# EAGLE design receiver (EAGLE 6.5.0)
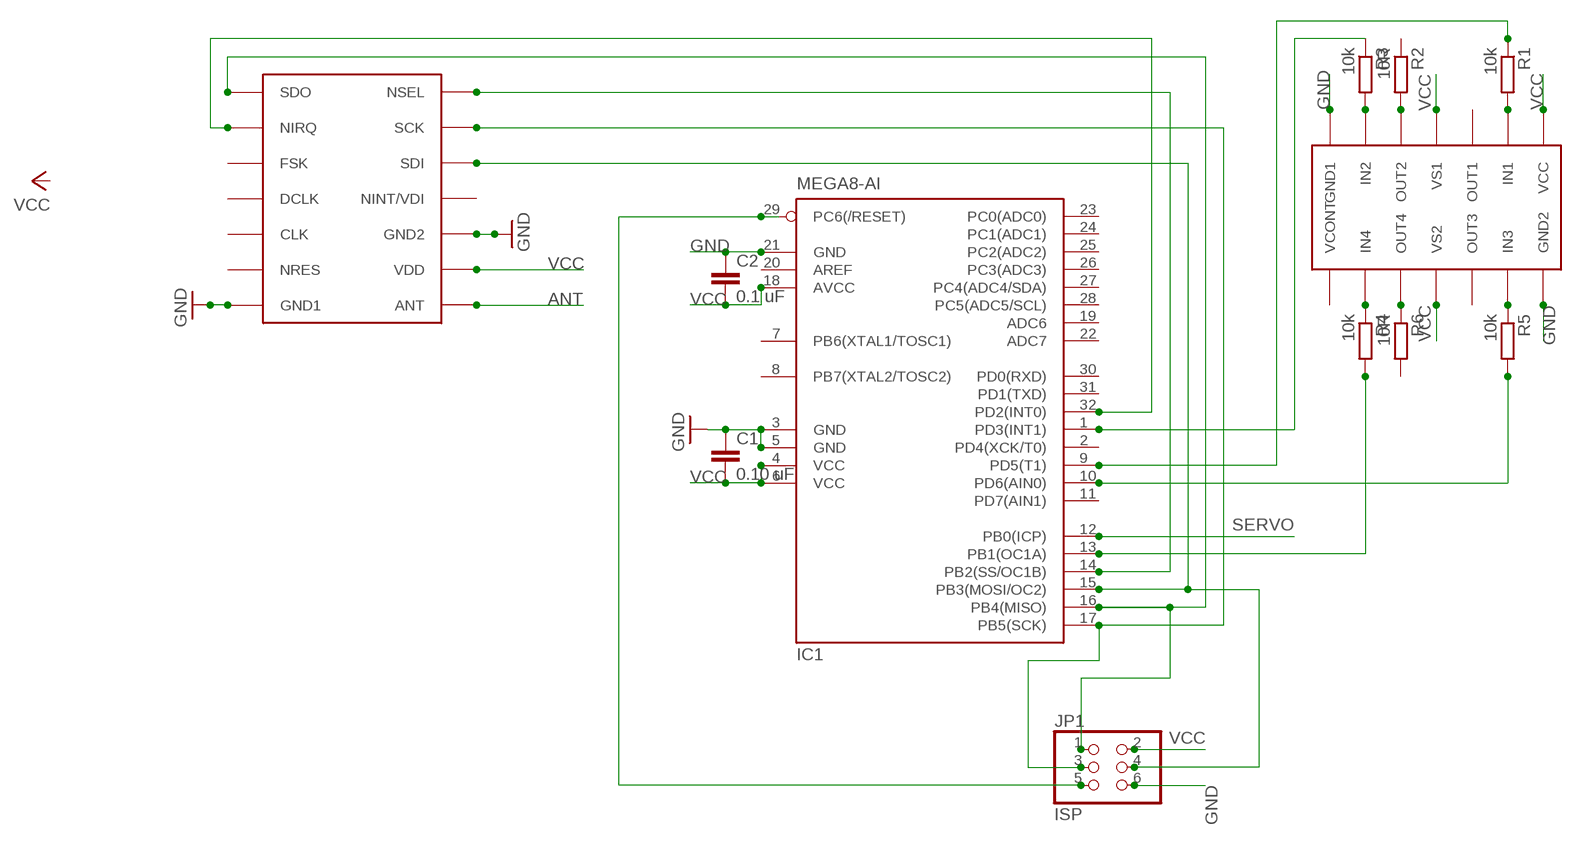
[diagram p0: schematic, sheet 1]

## Parts
C1  0.10 uF  C-EUC0805  [C0805]
C2  0.1 uF  C-EUC0805  [C0805]
IC1  MEGA8-AI  [TQFP32-08]
JP1  ISP  PINHD-2X3  [2X03]
LB1836M  LB1836M  [MFP-14]
R1  10k  R-EU_R2012  [R2012]
R2  10R  R-EU_R2012  [R2012]
R3  10k  R-EU_R2012  [R2012]
R4  10k  R-EU_R2012  [R2012]
R5  10k  R-EU_R2012  [R2012]
R6  10R  R-EU_R2012  [R2012]
RFM12B  RFM12B  [RFM12B]

## Nets
ANT: RFM12B.ANT
GND: C1.1 C2.1 IC1.3(GND) IC1.5(GND) IC1.21(GND) JP1.6 LB1836M.GN2(GND2) LB1836M.GND1 RFM12B.GND1 RFM12B.GND2
N$1: IC1.16(PB4(MISO)) JP1.1 RFM12B.SDO
N$2: IC1.15(PB3(MOSI/OC2)) JP1.4 RFM12B.SDI
N$3: IC1.17(PB5(SCK)) JP1.3 RFM12B.SCK
N$4: IC1.14(PB2(SS/OC1B)) RFM12B.NSEL
N$5: IC1.32(PD2(INT0)) RFM12B.NIRQ
N$6: LB1836M.IN1 R1.2
N$7: IC1.9(PD5(T1)) R1.1
N$8: LB1836M.IN2 R3.2
N$9: LB1836M.IN4 R4.1
N$10: LB1836M.IN3 R5.1
N$11: IC1.1(PD3(INT1)) R3.1
N$12: IC1.13(PB1(OC1A)) R4.2
N$13: IC1.10(PD6(AIN0)) R5.2
N$14: LB1836M.OUT2 R2.2
N$15: LB1836M.OUT4 R6.1
N$20: IC1.29(PC6(/RESET)) JP1.5
SERVO: IC1.12(PB0(ICP))
VCC: C1.2 C2.2 IC1.4(VCC) IC1.6(VCC) IC1.18(AVCC) JP1.2 LB1836M.VCC LB1836M.VS1 LB1836M.VS2 RFM12B.VDD
Unconnected: IC1.2(PD4(XCK/T0)) IC1.7(PB6(XTAL1/TOSC1)) IC1.8(PB7(XTAL2/TOSC2)) IC1.11(PD7(AIN1)) IC1.19(ADC6) IC1.20(AREF) IC1.22(ADC7) IC1.23(PC0(ADC0)) IC1.24(PC1(ADC1)) IC1.25(PC2(ADC2)) IC1.26(PC3(ADC3)) IC1.27(PC4(ADC4/SDA)) IC1.28(PC5(ADC5/SCL)) IC1.30(PD0(RXD)) IC1.31(PD1(TXD)) LB1836M.OUT1 LB1836M.OUT3 LB1836M.VCONT R2.1 R6.2 RFM12B.CLK RFM12B.DCLK/CFIL/FFIT(DCLK) RFM12B.FSK/DATA/NFFS(FSK) RFM12B.NINT/VDI RFM12B.NRES

## Library data of the parts
C1 C2 = resistor:C-EU: CAPACITOR, European symbol
IC1 = atmel:MEGA8: MICROCONTROLLER 8 Kbytes FLASH, 1 kbytes SRAM, 512 bytes EEPROM, USART, 6-channel 10 bit ADC, 2-channel 8 bit ADC Pin compatible with Atmega48, ATMega88, ATMega168 Source: avr.lbr; MPN: ATMEGA8-16AU; OC_FARNELL: 9171371; OC_NEWARK: 73M8863
JP1 = pinhead:PINHD-2X3: PIN HEADER
LB1836M = jeroen:LB1836M: The LB1836M is a low-saturation two-channel bidirectional motor driver IC for use in low-voltage applications. The LB1836M is a bipolar stepper-motor driver IC that is ideal for use in printers, FDDs, cameras and other portable devices.
R1-R6 = resistor:R-EU_: RESISTOR, European symbol
RFM12B = jeroen:RFM12B

## Board
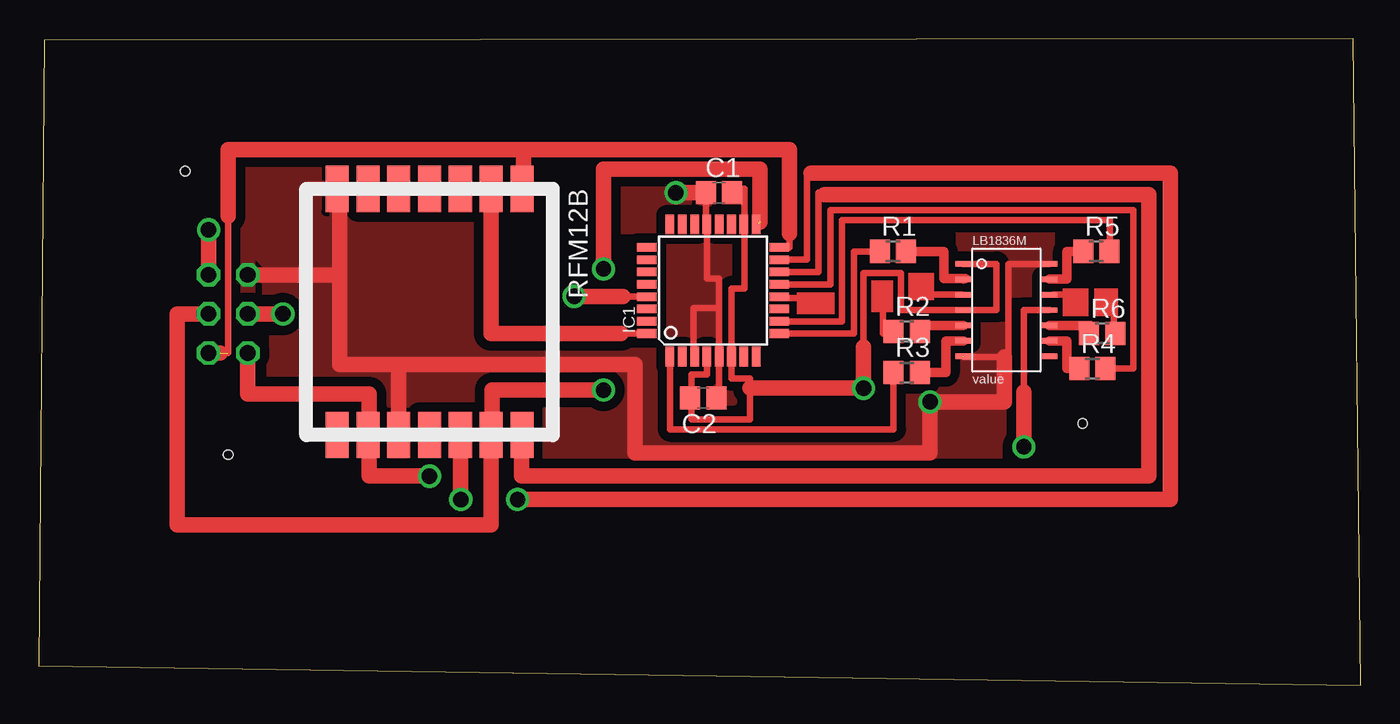
[diagram p1: board, top side]
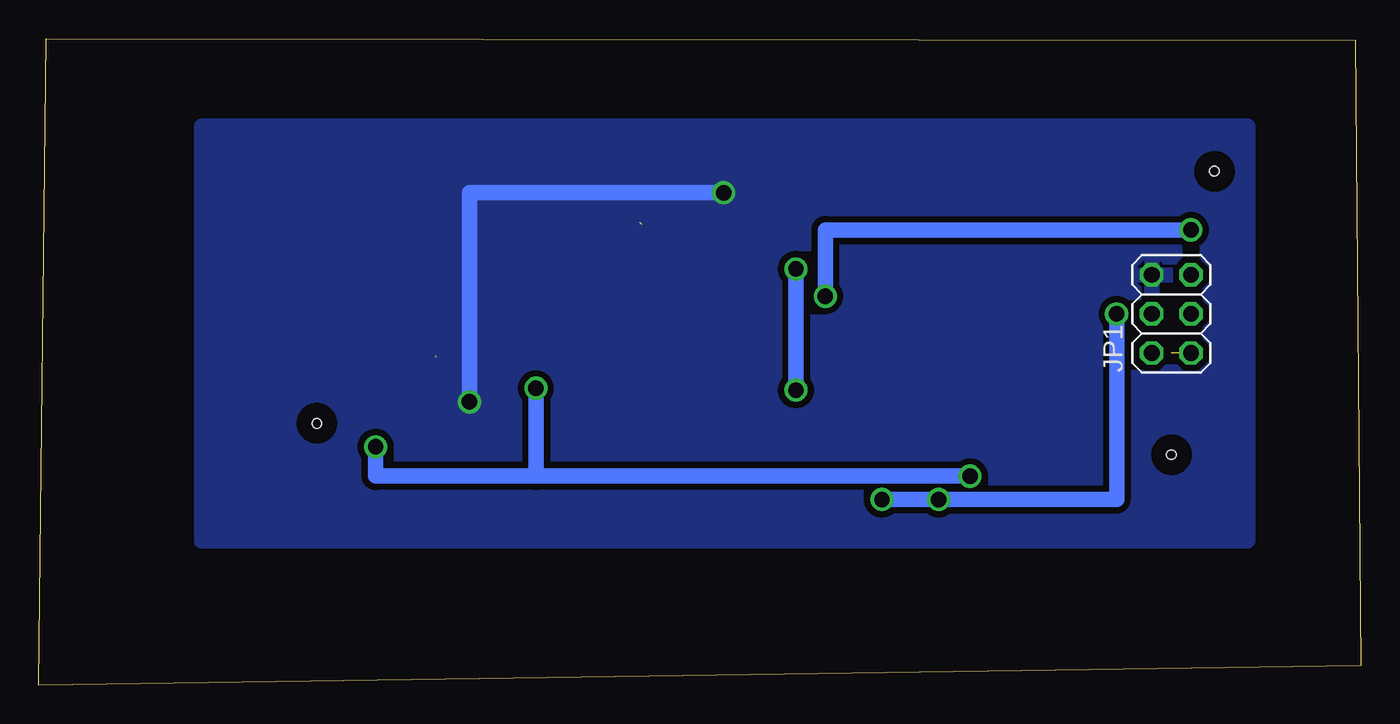
[diagram p2: board, bottom side, seen from below]

Size 85.9 x 42.03 mm. Coordinates in mm from the lower left corner, seen from the top.
Outline: 0,1.27 85.9,0 85.39,42.03 0.38,41.9 0,1.27
Copper layers (1*16): Top 0.035mm / dielectric 1.5mm / Bottom 0.035mm
Design rules "default": minimum track width 10mil, minimum drill 24mil, track to track 8mil, track to pad 8mil, pad to pad 8mil, via to via 8mil, smd to smd 8mil, copper to edge 40mil, drill to drill 8mil, minimum pad ring 10mil, minimum via ring 8mil, stop-mask expansion 4mil, vias tented up to drill 0mil, thermal gap 10mil
Holes 0.6 mm at 9.53,33.4 67.82,17.02 12.32,14.99

### Footprints (pad centres in the part's own frame; a part is rotated, then mirrored left to right if it is on the bottom)
C0805 = smd 1.3 x 1.5: 1 -0.85,0; 2 0.85,0
TQFP32-08 = smd 1.27 x 0.559: 1 -4.293,2.8; 2 -4.293,2; 3 -4.293,1.2; 4 -4.293,0.4; 5 -4.293,-0.4; 6 -4.293,-1.2; 7 -4.293,-2; 8 -4.293,-2.8; 17 4.293,-2.8; 18 4.293,-2; 19 4.293,-1.2; 20 4.293,-0.4; 21 4.293,0.4; 22 4.293,1.2; 23 4.293,2; 24 4.293,2.8 | smd 0.559 x 1.27: 9 -2.8,-4.293; 10 -2,-4.293; 11 -1.2,-4.293; 12 -0.4,-4.293; 13 0.4,-4.293; 14 1.2,-4.293; 15 2,-4.293; 16 2.8,-4.293; 25 2.8,4.293; 26 2,4.293; 27 1.2,4.293; 28 0.4,4.293; 29 -0.4,4.293; 30 -1.2,4.293; 31 -2,4.293; 32 -2.8,4.293
2X03 = drill 1.016 octagon: 1 -2.54,-1.27; 2 -2.54,1.27; 3 0,-1.27; 4 0,1.27; 5 2.54,-1.27; 6 2.54,1.27
MFP-14 = smd 1 x 0.35: GN2 2.8,3; GND1 -2.8,-3; IN1 -2.8,2; IN2 -2.8,-2; IN3 2.8,2; IN4 2.8,-2; OUT1 -2.8,1; OUT2 -2.8,-1; OUT3 2.8,1; OUT4 2.8,-1; VCC -2.8,3; VCONT 2.8,-3; VS1 -2.8,0; VS2 2.8,0
R2012 = smd 1.3 x 1.5: 1 -0.85,0; 2 0.85,0
RFM12B = smd 3 x 1.5: ANT 8,-6; CLK -8,-2; DCLK/CFIL/FFIT -8,0; FSK/DATA/NFFS -8,2; GND1 -8,-6; GND2 8,-2; NINT/VDI 8,0; NIRQ -8,4; NRES -8,-4; NSEL 8,6; SCK 8,4; SDI 8,2; SDO -8,6; VDD 8,-4

### Placement (x,y rotation side)
C1  44.2,32 0 top
C2  43.18,18.67 180 top
IC1  43.81,25.65 90 top
JP1  12.32,24.13 90 bottom
LB1836M  62.86,24.38 0 top
R1  55.5,28.19 0 top
R2  56.39,22.99 0 top
R3  56.39,20.32 0 top
R4  68.45,20.57 0 top
R5  68.71,28.19 0 top
R6  69.09,22.86 0 top
RFM12B  25.4,24.26 270 top

### Tracks (layer width: path | path; a pad name or v marks a point on that pad's centre or on a via)
GND  (via drill 1)  (1 unrouted)
  Top 0.406: 44.2,21.36 44.2,24.51 | 44.2,24.51 44.2,26.42 43.42,26.42 IC1.21 43.35,29.95 C1.1 | IC1.3 42.55,21.36 42.55,24.51 44.2,24.51 | IC1.5 44.2,21.36 | 44.2,21.36 44.2,18.67 C2.1 | LB1836M.GN2 62.99,27.38 62.99,21.34 62.74,21.34 60.06,21.34
  Top 1.016: RFM12B.GND1 19.56,31.75 19.56,26.67 | 19.56,26.67 19.56,20.83 23.4,20.83 | 23.4,20.83 RFM12B.GND2 | C1.1 v41.4,32 | 23.4,20.83 38.73,20.83 38.73,15.11 57.91,15.11 v57.91,18.41 62.74,18.41 62.74,21.34 | JP1.6 19.56,26.67
  Bottom 1.016: v41.4,32 57.91,32 v57.91,18.41
  pour Top (isolate 0.61): 6.73,36.7 75.56,36.7 75.56,9.27 6.73,9.27
  pour Bottom (isolate 0.406): 7.49,36.32 75.31,36.32 75.31,9.4 7.37,9.4 7.37,36.32
N$1  (1 unrouted)
  Top 0.406: 31.4,34.42 RFM12B.SDO | IC1.16 48.77,28.45 48.77,29.34 | 12.32,21.59 12.32,30.48
  Top 1.016: 31.5,34.8 48.77,34.8 48.77,29.34 | RFM12B.SDO 31.5,32.26 31.5,34.8 | 31.5,34.8 12.32,34.8 12.32,30.48 | JP1.1 11.81,21.59
N$2  (via drill 1)
  Top 0.406: IC1.15 49.91,27.65 49.91,33.27 50.17,33.27
  Top 1.016: RFM12B.SDI 27.43,16.26 v27.43,12.07 | v31.11,12.07 73.53,12.07 73.53,33.27 50.17,33.27 | JP1.4 v15.88,24.13
  Bottom 1.016: v31.11,12.07 v27.43,12.07 15.88,12.07 v15.88,24.13
N$3  (via drill 1 pad 1.42)  (1 unrouted)
  Top 0.406: IC1.17 | IC1.17 46.61,29.84 46.74,29.84 46.74,29.97 46.61,29.97 IC1.17
  Top 1.016: v36.7,19.18 29.46,19.18 29.46,16.26 RFM12B.SCK 29.4,10.41 9.02,10.41 9.02,24.13 JP1.3 | 46.86,30.1 46.86,33.53 36.7,33.53 v36.7,27.05
  Bottom 1.016: v36.7,27.05 v36.7,19.18
N$4
  Top 0.406: IC1.14 50.67,26.85 50.67,32 51.05,31.88
  Top 1.016: RFM12B.NSEL 31.37,16.26 31.37,13.59 72.14,13.59 72.14,31.88 51.05,31.88
N$5
  Top 0.406: IC1.32 38.23,22.85 37.85,22.86
  Top 1.016: 37.85,22.86 29.4,22.86 RFM12B.NIRQ
N$6
  Top 0.61: R1.2 58.8,28.19 58.8,26.42 60.19,26.42 LB1836M.IN1
N$7
  Top 0.406: IC1.9 52.96,22.85 52.96,28.19 R1.1
N$8
  Top 0.61: LB1836M.IN2 58.93,22.38 58.93,20.32 R3.2
N$9
  Top 0.61: LB1836M.IN4 66.8,22.38 66.8,20.57 R4.1
N$10
  Top 0.61: LB1836M.IN3 66.8,26.38 66.8,28.19 R5.1
N$11
  Top 0.406: IC1.1 41.02,16.64 55.54,16.64 R3.1
N$12
  Top 0.406: R4.2 71.12,20.57 71.12,30.86 51.44,30.86 51.44,26.03 48.11,26.03 IC1.13
N$13
  Top 0.406: R5.2 69.6,28.19 69.6,30.23 52.2,30.23 52.2,23.62 48.11,23.62 IC1.10
N$14
  Top 0.61: LB1836M.OUT2 59.69,23.38 56.9,23.37 R2.2
N$15
  Top 0.61: LB1836M.OUT4 68.33,23.38 68.33,23.37 R6.1
N$16
  Top 0.406: 54.86,25.27 54.86,22.86 55.5,22.86
N$17
  Top 0.406: 59.94,25.4 57.66,25.4
N$18
  Top 0.406: 65.91,25.4 67.82,25.4
N$19
  Top 0.406: 69.85,22.73 69.85,25.02
N$20  (via drill 1)
  Top 0.406: 37.97,25.27 39.52,25.27 IC1.29
  Top 1.016: v11.05,29.59 JP1.5 | v34.8,25.27 37.97,25.27
  Bottom 1.016: v34.8,25.27 34.8,29.59 v11.05,29.59
N$21
  Top 0.406: 48.13,25.15 49.78,25.15
VCC  (via drill 1)
  Top 0.406: 45.85,29.95 45.85,25.78 45.02,25.78 IC1.6 45.02,19.94 46.23,19.94 46.23,19.3 46.23,17.27 42.42,17.27 42.42,18.67 | RFM12B.VDD 21.34,16.26 | IC1.4 43.43,21.36 43.43,20.19 42.42,20.19 42.42,18.67 | C2.2 42.42,18.67 | IC1.18 45.85,29.95 | 45.85,29.95 45.85,32.26 45.05,32.26 C1.2 | 64.01,19.05 64.01,24.38 LB1836M.VS2 | LB1836M.VCC 62.23,27.38 62.23,24.38 LB1836M.VS1 56.01,24.38 56.01,26.8 53.59,26.8 53.59,21.97
  Top 1.016: RFM12B.VDD 21.46,16.13 21.46,13.59 v25.4,13.59 | v64.01,15.49 64.01,19.05 | 21.34,16.26 21.46,16.26 21.46,18.92 13.59,18.92 JP1.2 | 53.59,21.97 v53.59,19.3 46.23,19.3
  Bottom 1.016: v25.4,13.59 53.59,13.59 | 53.59,13.59 64.01,13.59 v64.01,15.49 | v53.59,19.3 53.59,13.59
(copper drawn outside any net)
  shapes: Top area x5